# Altium schematic sheet subckt_RF1_filter_bank.SchDoc: RF1 filter bank
size A3; DocumentNumber: 14; Revision: 0; SheetNumber: 14; SheetTotal: 19
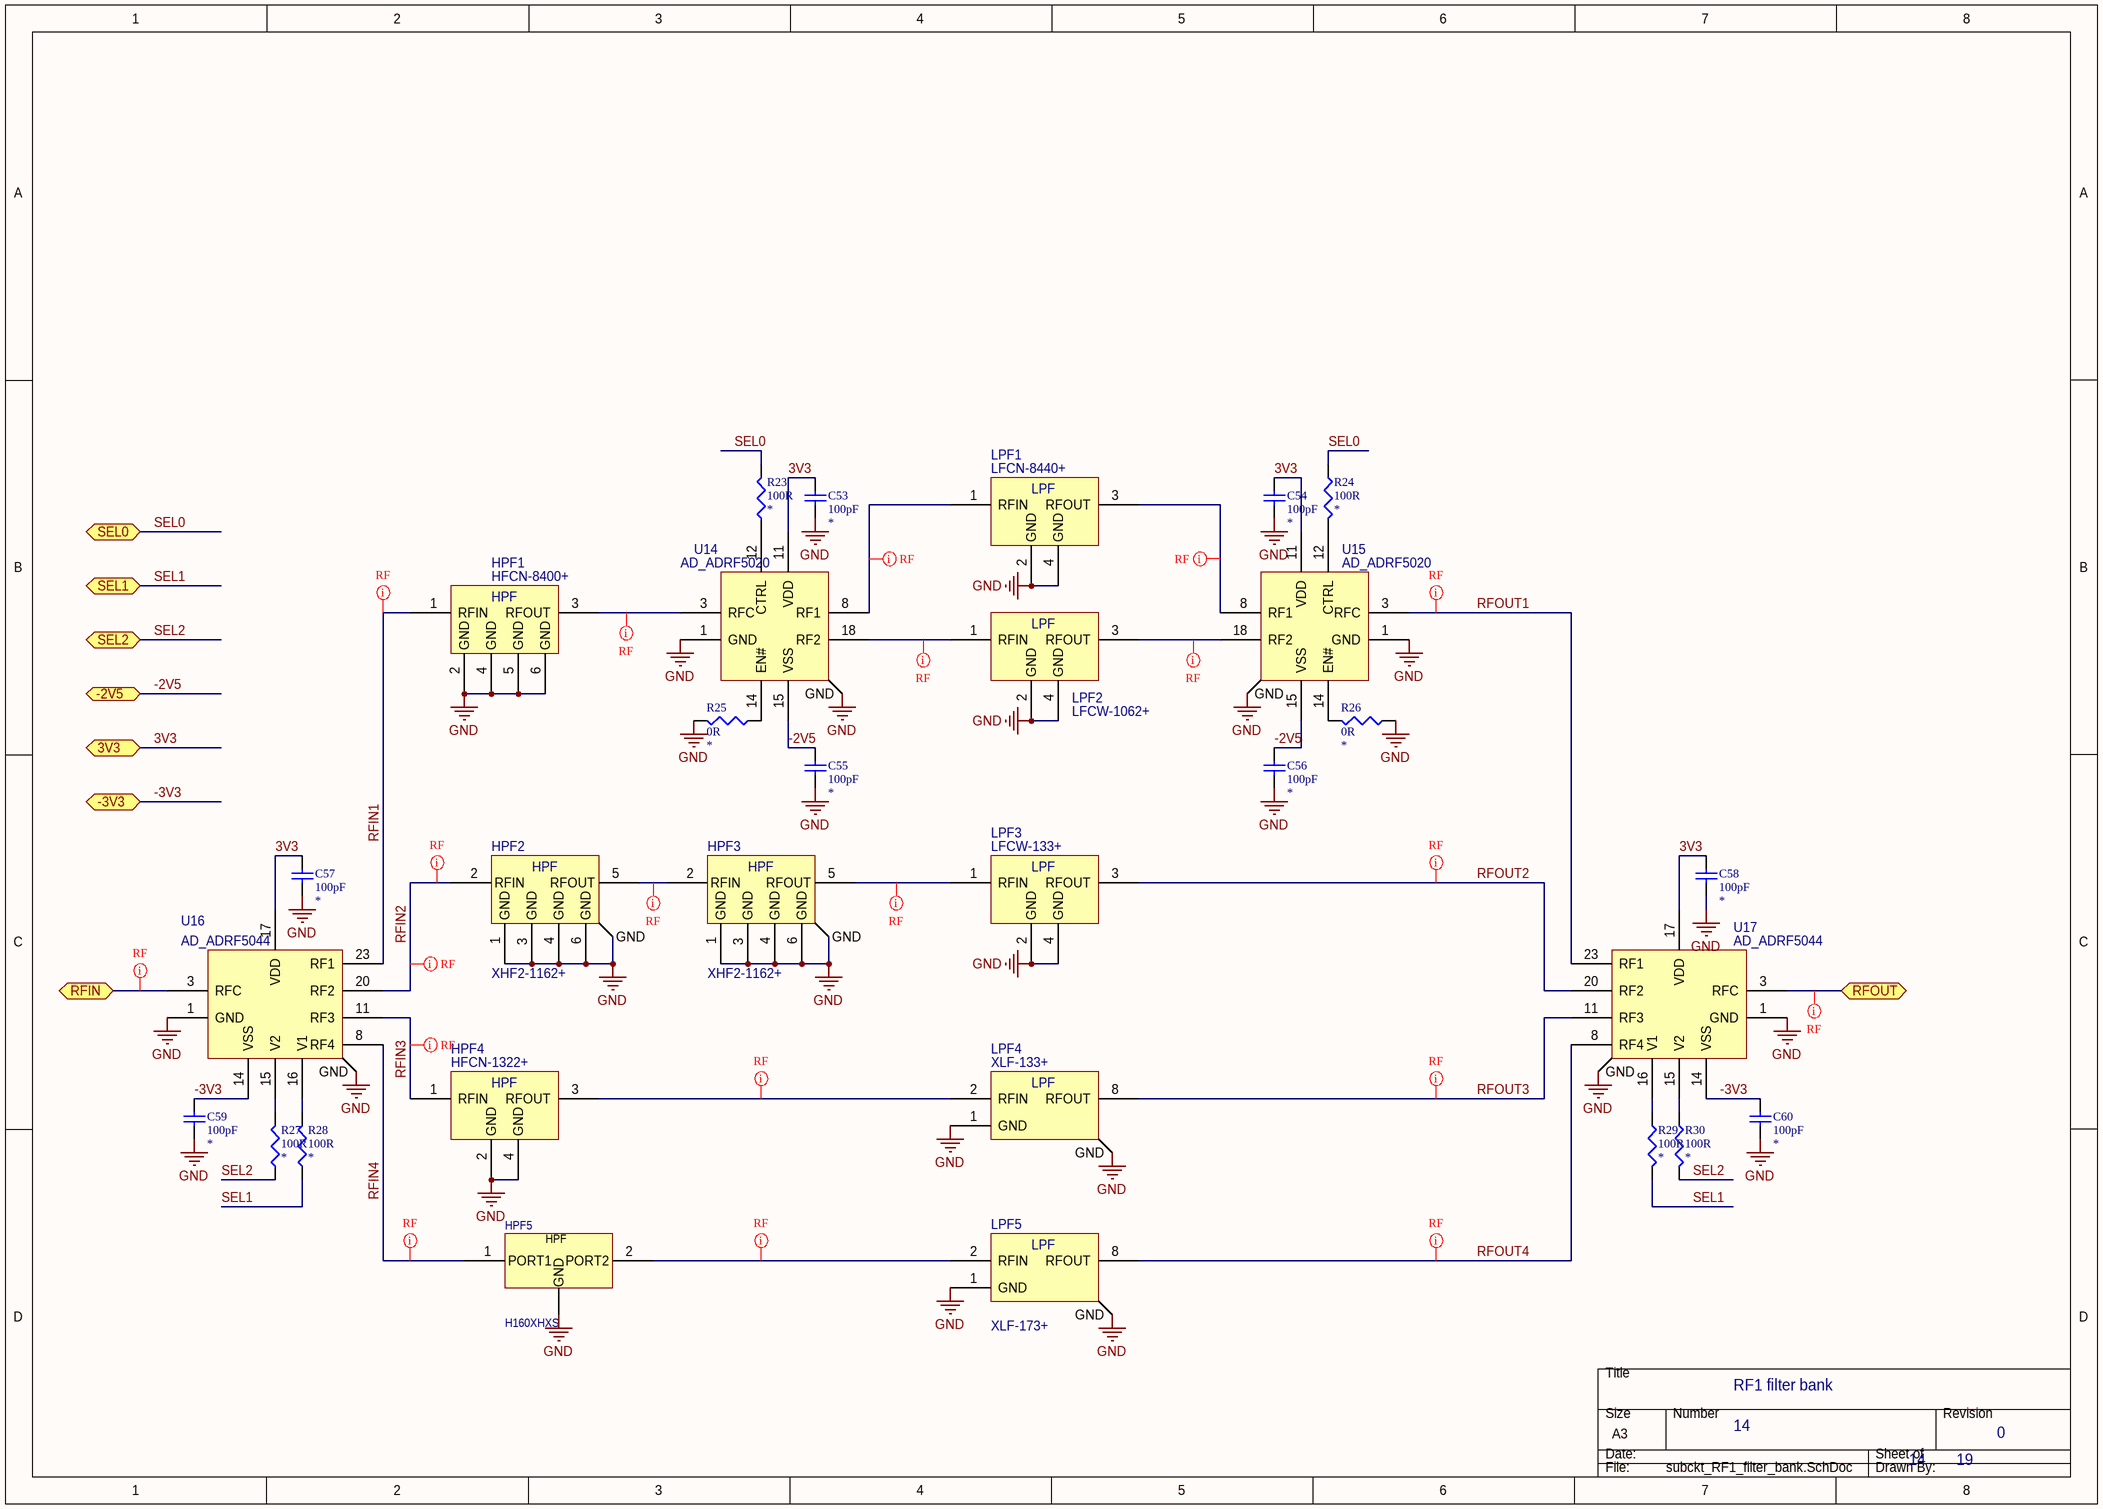
[diagram p0: subckt_RF1_filter_bank.SchDoc]

## Parts
C53  value 100pF  [TBD]  (hidden comment: Capacitor)
C54  value 100pF  [TBD]  (hidden comment: Capacitor)
C55  value 100pF  [TBD]  (hidden comment: Capacitor)
C56  value 100pF  [TBD]  (hidden comment: Capacitor)
C57  value 100pF  [TBD]  (hidden comment: Capacitor)
C58  value 100pF  [TBD]  (hidden comment: Capacitor)
C59  value 100pF  [TBD]  (hidden comment: Capacitor)
C60  value 100pF  [TBD]  (hidden comment: Capacitor)
HPF1  HFCN-8400+
HPF2  XHF2-1162+
HPF3  XHF2-1162+
HPF4  HFCN-1322+
HPF5  H160XHXS
LPF1  LFCN-8440+
LPF2  LFCW-1062+
LPF3  LFCW-133+
LPF4  XLF-133+
LPF5  XLF-173+
R23  value 100R  [RES0603]  (hidden comment: Resistor)
R24  value 100R  [RES0603]  (hidden comment: Resistor)
R25  value 0R  [RES0603]  (hidden comment: Resistor)
R26  value 0R  [RES0603]  (hidden comment: Resistor)
R27  value 100R  [RES0603]  (hidden comment: Resistor)
R28  value 100R  [RES0603]  (hidden comment: Resistor)
R29  value 100R  [RES0603]  (hidden comment: Resistor)
R30  value 100R  [RES0603]  (hidden comment: Resistor)
U14  AD_ADRF5020
U15  AD_ADRF5020
U16  AD_ADRF5044
U17  AD_ADRF5044

## Ports
3V3, -2V5, -3V3, RFIN, RFOUT, SEL0, SEL1, SEL2

## Nets
GND: C53.1 C54.1 C55.1 C56.1 C57.1 C58.1 C59.1 C60.1 HPF1.2(GND) HPF1.4(GND) HPF1.5(GND) HPF1.6(GND) HPF2.1(GND) HPF2.3(GND) HPF2.4(GND) HPF2.6(GND) HPF2.7(GND) HPF3.1(GND) HPF3.3(GND) HPF3.4(GND) HPF3.6(GND) HPF3.7(GND) HPF4.2(GND) HPF4.4(GND) HPF5.3(GND) LPF1.2(GND) LPF1.4(GND) LPF2.2(GND) LPF2.4(GND) LPF3.2(GND) LPF3.4(GND) LPF4.1(GND) LPF4.3(GND) LPF4.4(NC) LPF4.5(NC) LPF4.6(NC) LPF4.7(GND) LPF4.9(GND) LPF4.10(NC) LPF4.11(NC) LPF4.12(NC) LPF4.13(GND) LPF5.1(GND) LPF5.3(GND) LPF5.4(NC) LPF5.5(NC) LPF5.6(NC) LPF5.7(GND) LPF5.9(GND) LPF5.10(NC) LPF5.11(NC) LPF5.12(NC) LPF5.13(GND) R25.2 R26.2 U14.1(GND) U14.2(GND) U14.4(GND) U14.5(GND) U14.6(GND) U14.7(GND) U14.9(GND) U14.10(GND) U14.13(GND) U14.16(GND) U14.17(GND) U14.19(GND) U14.20(GND) U14.21(GND) U15.1(GND) U15.2(GND) U15.4(GND) U15.5(GND) U15.6(GND) U15.7(GND) U15.9(GND) U15.10(GND) U15.13(GND) U15.16(GND) U15.17(GND) U15.19(GND) U15.20(GND) U15.21(GND) U16.1(GND) U16.2(GND) U16.4(GND) U16.5(GND) U16.6(GND) U16.7(GND) U16.9(GND) U16.10(GND) U16.12(GND) U16.13(GND) U16.18(GND) U16.19(GND) U16.21(GND) U16.22(GND) U16.24(GND) U16.25(GND) U17.1(GND) U17.2(GND) U17.4(GND) U17.5(GND) U17.6(GND) U17.7(GND) U17.9(GND) U17.10(GND) U17.12(GND) U17.13(GND) U17.18(GND) U17.19(GND) U17.21(GND) U17.22(GND) U17.24(GND) U17.25(GND)
3V3: C53.2 C54.2 C57.2 C58.2 U14.11(VDD) U15.11(VDD) U16.17(VDD) U17.17(VDD) ; port 3V3
-2V5: C55.2 C56.2 U14.15(VSS) U15.15(VSS) ; port -2V5
-3V3: C59.2 C60.2 U16.14(VSS) U17.14(VSS) ; port -3V3
RFIN: U16.3(RFC) ; port RFIN
RFIN1: HPF1.1(RFIN) U16.23(RF1)
RFIN2: HPF2.2(RFIN) U16.20(RF2)
RFIN3: HPF4.1(RFIN) U16.11(RF3)
RFIN4: HPF5.1(PORT1) U16.8(RF4)
RFOUT: U17.3(RFC) ; port RFOUT
RFOUT1: U15.3(RFC) U17.23(RF1)
RFOUT2: LPF3.3(RFOUT) U17.20(RF2)
RFOUT3: LPF4.8(RFOUT) U17.11(RF3)
RFOUT4: LPF5.8(RFOUT) U17.8(RF4)
SEL0: R23.2 R24.2 ; port SEL0
SEL1: R28.1 R29.1 ; port SEL1
SEL2: R27.1 R30.1 ; port SEL2
NetHPF1_3: HPF1.3(RFOUT) U14.3(RFC)
NetHPF2_5: HPF2.5(RFOUT) HPF3.2(RFIN)
NetHPF3_5: HPF3.5(RFOUT) LPF3.1(RFIN)
NetHPF4_3: HPF4.3(RFOUT) LPF4.2(RFIN)
NetHPF5_2: HPF5.2(PORT2) LPF5.2(RFIN)
NetLPF1_1: LPF1.1(RFIN) U14.8(RF1)
NetLPF1_3: LPF1.3(RFOUT) U15.8(RF1)
NetLPF2_1: LPF2.1(RFIN) U14.18(RF2)
NetLPF2_3: LPF2.3(RFOUT) U15.18(RF2)
NetR23_1: R23.1 U14.12(CTRL)
NetR24_1: R24.1 U15.12(CTRL)
NetR25_1: R25.1 U14.14(EN#)
NetR26_1: R26.1 U15.14(EN#)
NetR27_2: R27.2 U16.15(V2)
NetR28_2: R28.2 U16.16(V1)
NetR29_2: R29.2 U17.16(V1)
NetR30_2: R30.2 U17.15(V2)

## Layout directives
net class RF: NetHPF1_3, NetHPF2_5, NetHPF3_5, NetHPF4_3, NetHPF5_2, NetLPF1_1, NetLPF1_3, NetLPF2_1, NetLPF2_3, RFIN, RFIN1, RFIN2, RFIN3, RFIN4, RFOUT, RFOUT1, RFOUT2, RFOUT3, RFOUT4

## Notes on the sheet
- (in symbol knowles_H160XHXS) HPF
- (in symbol minicircuits_HFCN-1322+) HPF
- (in symbol minicircuits_HFCN-8400+) HPF
- (in symbol minicircuits_LFCN-8440+) LPF
- (in symbol minicircuits_LFCW-133+) LPF
- (in symbol minicircuits_LFCW-1062+) LPF
- (in symbol minicircuits_XHF2-1162+) HPF
- (in symbol minicircuits_XLF-133+) LPF
- (in symbol minicircuits_XLF-173+) LPF

## Library data of the parts
HPF1 = minicircuits_HFCN-8400+
HPF2 HPF3 = minicircuits_XHF2-1162+: HPF 11.6GHz-30GHz
HPF4 = minicircuits_HFCN-1322+: HPF 14.3GHZ-18.5GHZ
HPF5 = knowles_H160XHXS: HPF 16GHz
LPF1 = minicircuits_LFCN-8440+: LPF 8440MHz
LPF2 = minicircuits_LFCW-1062+: LPF 10.6GHz
LPF3 = minicircuits_LFCW-133+: LPF 13.25GHz
LPF4 = minicircuits_XLF-133+: LPF 13.1GHz
LPF5 = minicircuits_XLF-173+: LPF 17.0GHz
U14 U15 = AD_ADRF5020: AD SPDT Switch, 100MHz-30GHz
U16 U17 = AD_ADRF5044: AD SP4T Switch, 100MHz-30GHz
C53-C60 = Capacitor: Dielectric: *
R23-R30 = Resistor: Type: *